# EAGLE design interface (EAGLE 9.4.2)
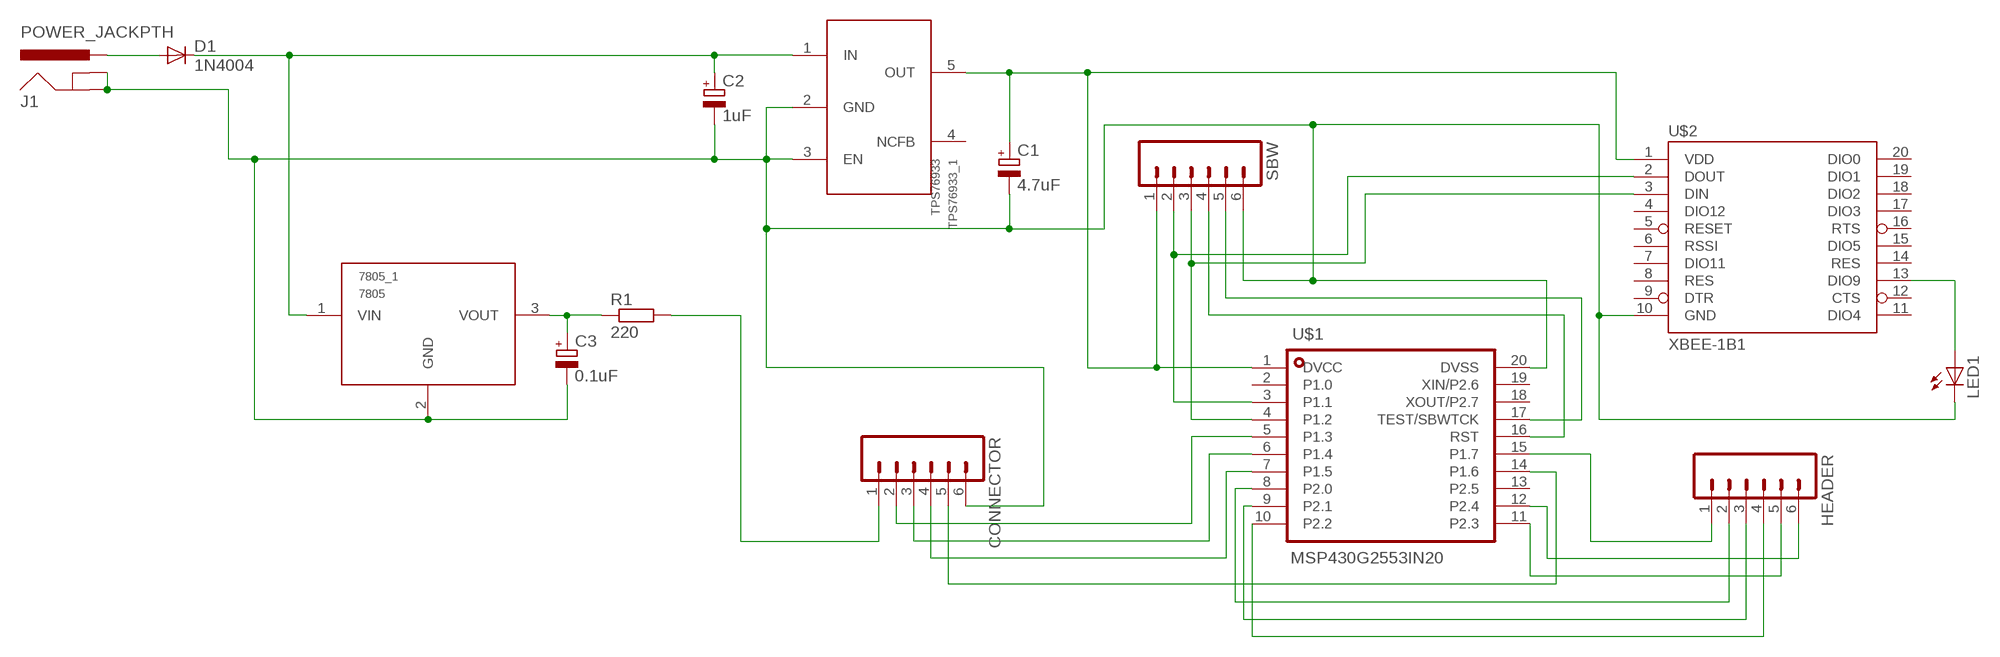
[diagram p0: schematic, sheet 1]

## Parts
7805_1  7805  [TO-220]
C1  4.7uF  CPOL-EUE1.8-4  [E1,8-4]
C2  1uF  CPOL-EUE1.8-4  [E1,8-4]
C3  0.1uF  CPOL-EUE1.8-4  [E1,8-4]
CONNECTOR  M06_90SIP  [1X06_90]
D1  1N4004  [DO41-10]
HEADER  M06_180SIP  [1X06_180]
J1  POWER_JACKPTH  [POWER_JACK_PTH]
LED1  LED3MM  [LED3MM]
R1  220  R-EU_0204/7  [0204/7]
SBW  M06_180SIP  [1X06_180]
TPS76933_1  TPS76933  [SOT23-5]
U$1  MSP430G2553IN20  [DIP20]
U$2  XBEE-1B1  [XBEE-1]

## Nets
GND: 7805_1.2(GND) C1.- C2.- C3.- CONNECTOR.6 J1.GND J1.GNDBREAK LED1.K(C) SBW.6 TPS76933_1.2(GND) TPS76933_1.3(EN) U$1.20(DVSS) U$2.10(GND)
N$1: CONNECTOR.3 U$1.6(P1.4)
N$2: CONNECTOR.2 U$1.5(P1.3)
N$3: CONNECTOR.4 U$1.7(P1.5)
N$4: SBW.4 U$1.16(RST)
N$5: SBW.5 U$1.17(TEST/SBWTCK)
N$6: CONNECTOR.5 U$1.14(P1.6)
N$7: D1.A J1.PWR
N$8: LED1.A U$2.13(DIO9)
N$9: 7805_1.1(VIN) C2.+ D1.C TPS76933_1.1(IN)
N$10: 7805_1.3(VOUT) C3.+ R1.1
N$11: HEADER.1 U$1.15(P1.7)
N$12: HEADER.2 U$1.8(P2.0)
N$13: HEADER.3 U$1.9(P2.1)
N$14: HEADER.4 U$1.10(P2.2)
N$15: HEADER.5 U$1.11(P2.3)
N$16: HEADER.6 U$1.12(P2.4)
UART_1: SBW.2 U$1.3(P1.1) U$2.2(DOUT)
UART_2: SBW.3 U$1.4(P1.2) U$2.3(DIN)
VCC_3V: C1.+ SBW.1 TPS76933_1.5(OUT) U$1.1(DVCC) U$2.1(VDD)
VCC_5V: CONNECTOR.1 R1.2
Unconnected: TPS76933_1.4(NCFB) U$1.2(P1.0) U$1.13(P2.5) U$1.18(XOUT/P2.7) U$1.19(XIN/P2.6) U$2.4(DIO12) U$2.5(RESET) U$2.6(RSSI) U$2.7(DIO11) U$2.8(RES) U$2.9(DTR) U$2.11(DIO4) U$2.12(CTS) U$2.14(RES) U$2.15(DIO5) U$2.16(RTS) U$2.17(DIO3) U$2.18(DIO2) U$2.19(DIO1) U$2.20(DIO0)

## Library data of the parts
7805_1 = interfaceSARI:7805: Regulador de tensão 5V
C1-C3 = rcl:CPOL-EU: POLARIZED CAPACITOR, European symbol
CONNECTOR = interfaceSARI:M06_90: Header 6 Standard 6-pin 0.1" header. Use with straight break away headers (SKU : PRT-00116), right angle break away headers (PRT-00553), swiss pins (PRT-00743), machine pins (PRT-00117), and female headers (PRT-00115). Molex polarized connector foot print use with SKU : PRT-08094 with associated crimp pins and housings. NOTES ON THE VARIANTS LOCK and LOCK_LONGPADS... This footprint was designed to help hold the alignment of a through-hole component (i.e. 6-pin header) while soldering it into place. You may notice that each hole has been shifted either up or down by 0.005 of an inch from it's more standard position (which is a perfectly straight line). This slight alteration caused the pins (the squares in the middle) to touch the edges of the holes. Because they are alternating, it causes a "brace" to hold the component in place. 0.005 has proven to be the perfect amount of "off-center" position when using our standard breakaway headers. Although looks a little odd when you look at the bare footprint, once you have a header in there, the alteration is very hard to notice. Also, if you push a header all the way into place, it is covered up entirely on the bottom side. This idea of altering the position of holes to aid alignment will be further integrated into the Sparkfun Library for other footprints. It can help hold any component with 3 or more connection pins.
D1 = diode:1N4004: DIODE general purpose rectifier, 1 A
HEADER SBW = interfaceSARI:M06_180: Header 6 Standard 6-pin 0.1" header. Use with straight break away headers (SKU : PRT-00116), right angle break away headers (PRT-00553), swiss pins (PRT-00743), machine pins (PRT-00117), and female headers (PRT-00115). Molex polarized connector foot print use with SKU : PRT-08094 with associated crimp pins and housings. NOTES ON THE VARIANTS LOCK and LOCK_LONGPADS... This footprint was designed to help hold the alignment of a through-hole component (i.e. 6-pin header) while soldering it into place. You may notice that each hole has been shifted either up or down by 0.005 of an inch from it's more standard position (which is a perfectly straight line). This slight alteration caused the pins (the squares in the middle) to touch the edges of the holes. Because they are alternating, it causes a "brace" to hold the component in place. 0.005 has proven to be the perfect amount of "off-center" position when using our standard breakaway headers. Although looks a little odd when you look at the bare footprint, once you have a header in there, the alteration is very hard to notice. Also, if you push a header all the way into place, it is covered up entirely on the bottom side. This idea of altering the position of holes to aid alignment will be further integrated into the Sparkfun Library for other footprints. It can help hold any component with 3 or more connection pins.
J1 = SparkFun:POWER_JACK: Power Jack This is the standard 5.5mm barrel jack for power. The PTH is the most common, proven, reliable, footprint. All others are experimental. The Slot footprint only works if the mill layer is transmitted to the PCB fab house so be warned. Spark Fun Electronics SKU : PRT-00119. Mating wall wart : TOL-00298 (and others)
LED1 = SparkFun:LED: LEDs Standard schematic elements and footprints for 5mm, 3mm, 1206, and 0603 sized LEDs. 5mm - Spark Fun Electronics SKU : COM-00529 (and others)
R1 = resistor:R-EU_: RESISTOR, European symbol
TPS76933_1 = interfaceSARI:TPS76933
U$1 = interfaceSARI:MSP430G2553
U$2 = interfaceSARI:XBEE-1

## Board
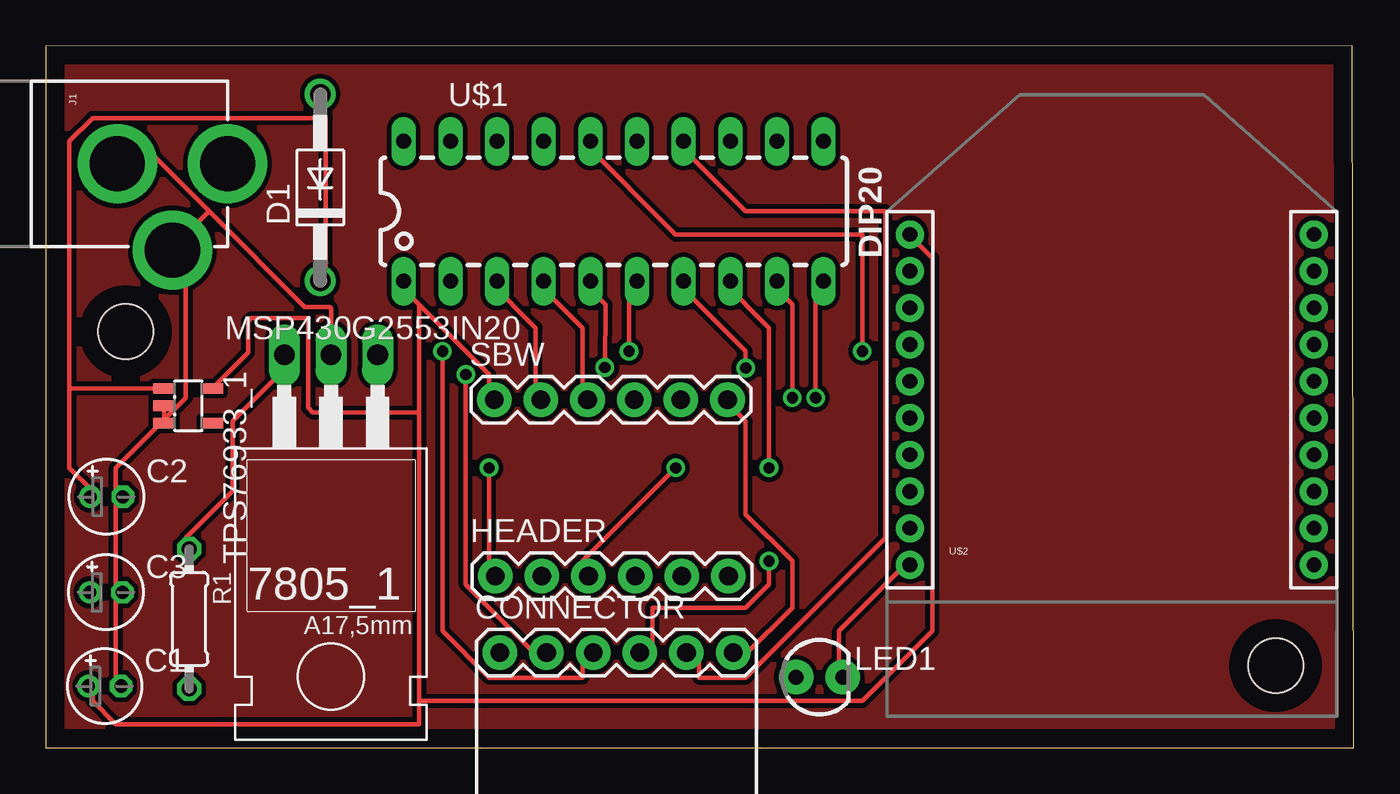
[diagram p1: board, top side]
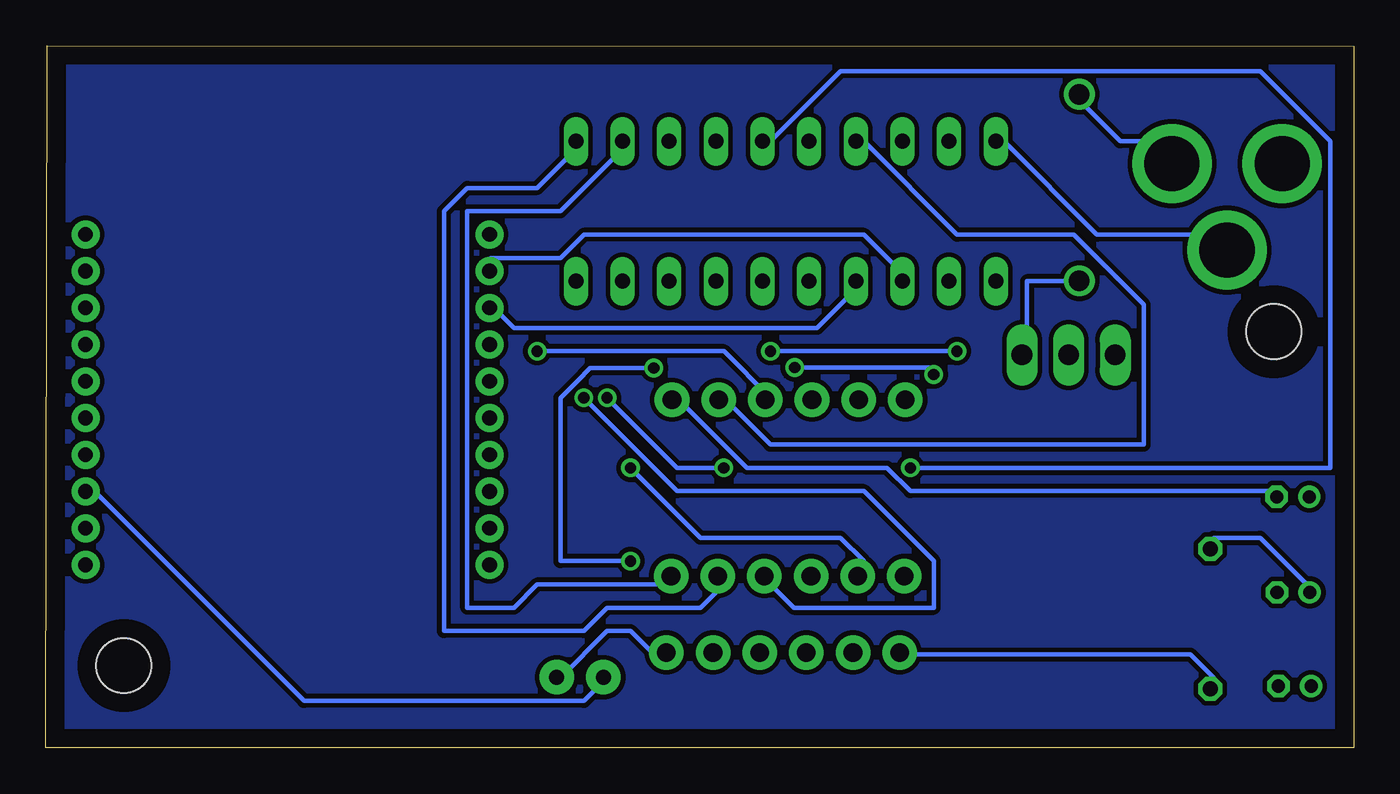
[diagram p2: board, bottom side, seen from below]

Size 71.2 x 38.22 mm. Coordinates in mm from the lower left corner, seen from the top.
Outline: 0,0 71.2,0 71.12,38.22 0,38.19 0,0
Copper layers (1*16): Top 0.035mm / dielectric 1.5mm / Bottom 0.035mm
Design rules "default": minimum track width 10mil, minimum drill 24mil, track to track 8mil, track to pad 8mil, pad to pad 8mil, via to via 8mil, smd to smd 8mil, copper to edge 40mil, drill to drill 8mil, minimum pad ring 10mil, minimum via ring 8mil, stop-mask expansion 4mil, vias tented up to drill 0mil, thermal gap 10mil
Holes 3 mm at 4.34,22.66 66.95,4.47

### Footprints (pad centres in the part's own frame; a part is rotated, then mirrored left to right if it is on the bottom)
TO-220 = drill 1.118 long: 1 -2.54,-11.43; 2 0,-11.43; 3 2.54,-11.43
E1,8-4 = drill 0.711 pad 1.168: + -0.889,0 | drill 0.711 pad 1.168 octagon: - 0.889,0
1X06_90 = drill 1.016 pad 1.88: 1 0,0; 2 2.54,0; 3 5.08,0; 4 7.62,0; 5 10.16,0; 6 12.7,0
DO41-10 = drill 1.118: A 5.08,0; C -5.08,0
1X06_180 = drill 1.016 pad 1.88: 1 0,0; 2 2.54,0; 3 5.08,0; 4 7.62,0; 5 10.16,0; 6 12.7,0
POWER_JACK_PTH = drill 2.997 pad 4.318: GND 0,7.7; GNDBREAK 4.7,10.7; PWR 0,13.7
LED3MM = drill 0.813 pad 1.88: A -1.27,0; K 1.27,0
0204/7 = drill 0.813 octagon: 1 -3.81,0; 2 3.81,0
SOT23-5 = smd 0.55 x 1.2: 1 -0.95,-1.3; 2 0,-1.3; 3 0.95,-1.3; 4 0.95,1.3; 5 -0.95,1.3
DIP20 = drill 0.813 pad 1.27 long: 1 -11.43,-3.81 | drill 0.813 long: 2 -8.89,-3.81; 3 -6.35,-3.81; 4 -3.81,-3.81; 5 -1.27,-3.81; 6 1.27,-3.81; 7 3.81,-3.81; 8 6.35,-3.81; 9 8.89,-3.81; 10 11.43,-3.81; 11 11.43,3.81; 12 8.89,3.81; 13 6.35,3.81; 14 3.81,3.81; 15 1.27,3.81; 16 -1.27,3.81; 17 -3.81,3.81; 18 -6.35,3.81; 19 -8.89,3.81; 20 -11.43,3.81
XBEE-1 = drill 0.8 pad 1.524: 1 -11,20; 2 -11,18; 3 -11,16; 4 -11,14; 5 -11,12; 6 -11,10; 7 -11,8; 8 -11,6; 9 -11,4; 10 -11,2; 11 11,2; 12 11,4; 13 11,6; 14 11,8; 15 11,10; 16 11,12; 17 11,14; 18 11,16; 19 11,18; 20 11,20

### Placement (x,y rotation side)
7805_1  15.52,9.96 180 top
C1  3.2,3.35 0 top
C2  3.3,13.67 0 top
C3  3.28,8.46 0 top
CONNECTOR  24.71,5.18 0 top
D1  14.94,30.51 90 top
HEADER  24.46,9.35 0 top
J1  -3.81,31.8 270 top
LED1  42.11,3.84 0 top
R1  7.8,7.01 270 top
SBW  24.41,18.95 0 top
TPS76933_1  7.75,18.62 270 top
U$1  30.91,29.21 0 top
U$2  58.04,7.95 0 top

### Tracks (layer width: path | path; a pad name or v marks a point on that pad's centre or on a via)
GND
  Top 0.254: 8.89,29.21 5.08,33.02 J1.GND | U$2.10 46.99,10.16 43.18,6.35 43.18,3.81 LED1.K | SBW.6 36.83,19.05 38.1,17.78 38.1,12.7 40.64,10.16 40.64,7.62 38.1,5.08 CONNECTOR.6 | 6.35,17.78 3.81,15.24 3.81,13.97 | 3.81,8.89 3.81,3.81 C1.- | 3.81,8.89 3.81,13.97 | 3.81,13.97 C2.- | 3.81,8.89 C3.- | 6.35,17.78 7.62,19.05 7.62,26.67 J1.GNDBREAK 7.62,27.94 8.89,29.21 | 6.35,17.78 TPS76933_1.3 6.45,18.59 6.4,18.59 6.4,18.62 TPS76933_1.2 | 8.89,29.21 14.1,24 15.47,24 15.52,23.95 7805_1.2
  Bottom 0.254: CONNECTOR.6 38.1,5.08 39.37,6.35 40.64,6.35 43.18,3.81 LED1.K | U$1.20 19.05,33.02 13.97,27.94 7.62,27.94 J1.GNDBREAK | SBW.6 36.83,19.05 33.02,15.24 25.4,15.24 24.13,13.97 3.81,13.97 C2.-
N$1  (via drill 0.61)
  Top 0.254: v31.75,21.59 31.75,25.4 U$1.6 | v21.59,21.59 21.59,6.35 24.13,3.81 29.21,3.81 29.21,5.08 CONNECTOR.3
  Bottom 0.254: v21.59,21.59 v31.75,21.59
N$2  (via drill 0.61)
  Top 0.254: v30.43,20.7 30.48,24.13 29.21,25.4 U$1.5 | v22.86,20.32 22.86,8.89 26.67,5.08 CONNECTOR.2
  Bottom 0.254: v22.86,20.32 22.86,20.7 v30.43,20.7
N$3  (via drill 0.61)
  Top 0.254: v38.1,20.68 38.1,21.59 34.29,25.4 U$1.7 | v39.37,10.16 39.37,8.89 38.1,7.62 33.02,7.62 33.02,5.08 CONNECTOR.4
  Bottom 0.254: v38.1,20.68 41.58,20.68 41.91,20.34 41.91,20.32 43.18,19.05 43.18,10.16 v39.37,10.16
N$4  (via drill 0.61)
  Top 0.254: v44.45,21.59 44.45,27.94 34.29,27.94 29.21,33.02 U$1.16
  Bottom 0.254: v44.45,21.59 34.29,21.59 31.75,19.05 SBW.4
N$5
  Bottom 0.254: U$1.17 26.67,33.02 21.59,27.94 15.24,27.94 11.43,24.13 11.43,16.51 31.75,16.51 34.29,19.05 SBW.5
N$6
  Top 0.254: U$1.14 34.29,33.02 38.1,29.21 45.72,29.21 45.72,11.43 38.1,3.81 35.56,3.81 35.56,5.08 CONNECTOR.5
N$7
  Bottom 0.254: D1.A 15.24,35.56 12.7,33.02 10.16,33.02 J1.PWR
N$8
  Bottom 0.254: U$2.13 68.58,13.97 57.15,2.54 41.91,2.54 40.64,3.81 LED1.A
N$9
  Top 0.254: 1.27,19.57 1.27,15.24 2.54,13.97 C2.+ | D1.C 15.24,25.4 15.24,34.29 2.54,34.29 1.27,33.02 1.27,19.71 1.27,19.57 | TPS76933_1.1 1.27,19.57
  Bottom 0.254: 7805_1.1 17.78,21.59 17.78,25.4 15.24,25.4 D1.C
N$10
  Top 0.254: 7805_1.3 12.7,20.32 10.16,17.78 10.16,13.97 7.62,11.43 R1.1
  Bottom 0.254: C3.+ 2.54,8.89 5.08,11.43 7.62,11.43 R1.1
N$11  (via drill 0.61)
  Top 0.254: v24.13,15.24 24.13,10.16 HEADER.1
  Bottom 0.254: v24.13,15.24 1.27,15.24 1.27,33.02 5.08,36.83 27.94,36.83 31.75,33.02 U$1.15
N$12  (via drill 0.61)
  Top 0.254: v39.37,15.24 39.37,22.86 36.83,25.4 U$1.8
  Bottom 0.254: v39.37,15.24 35.56,11.43 27.94,11.43 26.67,10.16 HEADER.2
N$13  (via drill 0.61)
  Top 0.254: v40.64,19.05 40.64,24.13 39.37,25.4 U$1.9 | v34.29,15.24 29.21,10.16 HEADER.3
  Bottom 0.254: v40.64,19.05 36.83,15.24 v34.29,15.24
N$14  (via drill 0.61)
  Top 0.254: v41.91,19.05 41.91,25.4 U$1.10
  Bottom 0.254: v41.91,19.05 36.83,13.97 26.67,13.97 22.86,10.16 22.86,7.62 30.48,7.62 31.75,8.89 HEADER.4
N$15
  Bottom 0.254: U$1.11 41.91,33.02 44.45,30.48 48.26,30.48 49.53,29.21 49.53,6.35 41.91,6.35 40.64,7.62 35.56,7.62 34.29,8.89 HEADER.5
N$16
  Bottom 0.254: U$1.12 39.37,33.02 43.18,29.21 48.26,29.21 48.26,7.62 45.72,7.62 44.45,8.89 36.83,8.89 HEADER.6
N$17
  pour Bottom (isolate 0.254): 0.13,0.13 70.89,0.13 70.89,38.05 0.13,38.05
N$18
  pour Top (isolate 0.254): 0.36,37.87 70.97,37.87 70.97,0.13 0.36,0.13
UART_1
  Top 0.254: U$1.3 24.13,25.4 26.67,22.86 26.67,19.05 SBW.2
  Bottom 0.254: U$2.2 46.99,26.67 43.18,26.67 41.91,27.94 26.67,27.94 24.13,25.4 U$1.3
UART_2
  Top 0.254: U$1.4 26.67,25.4 29.21,22.86 29.21,19.05 SBW.3
  Bottom 0.254: U$2.3 46.99,24.13 45.72,22.86 29.21,22.86 26.67,25.4 U$1.4
VCC_3V
  Top 0.254: 20.32,24.13 20.32,18.26 | 20.32,18.26 20.32,2.54 | 20.32,2.54 20.32,1.27 3.81,1.27 2.54,2.54 2.54,3.81 C1.+ | 20.32,24.13 19.05,25.4 U$1.1 | 20.32,2.54 44.45,2.54 48.26,6.35 48.26,26.67 46.99,27.94 U$2.1 | 20.32,24.13 24.13,20.32 24.13,19.05 SBW.1 | TPS76933_1.5 11,21.52 11,23.22 11.18,23.39 14.3,23.39 14.28,23.37 14.28,18.52 14.53,18.26 20.32,18.26
VCC_5V
  Bottom 0.254: R1.2 7.62,3.81 8.89,5.08 24.13,5.08 CONNECTOR.1

### Text on the board
Document: 7.11 cm | 3.81 cm